# EAGLE schematic GainAmp (EAGLE 9.6.2)
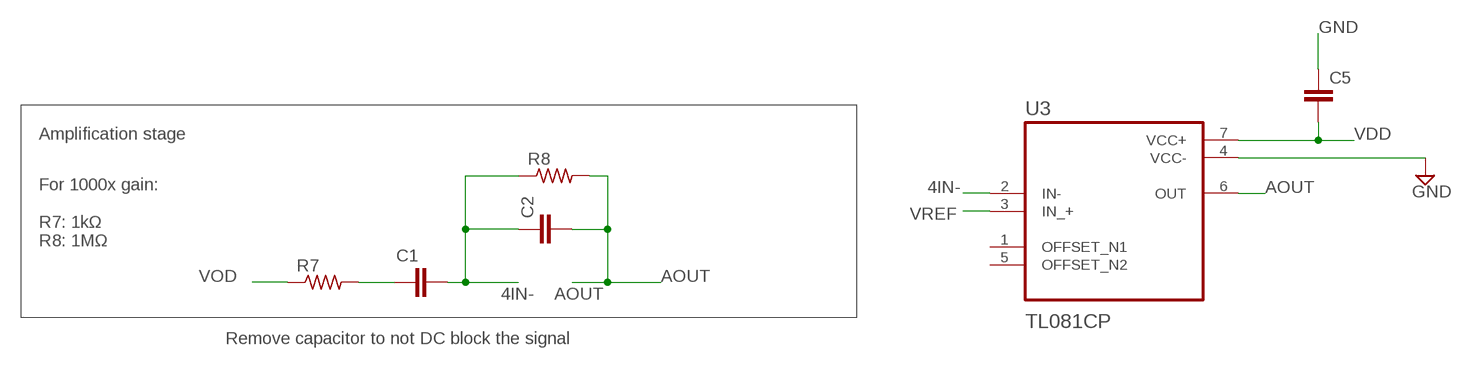
[diagram p0: schematic, sheet 1]

## Parts
C1  C2.5/2  [C2.5-2]
C2  C2.5/2  [C2.5-2]
C5  C2.5/2  [C2.5-2]
R7  R-US_0204/5  [0204/5]
R8  R-US_0204/5  [0204/5]
U3  TL081CP  [DIP794W45P254L959H508Q8]

## Nets
4IN-: C1.2 C2.1 R8.1 U3.2(IN-)
AOUT: C2.2 R8.2 U3.6(OUT)
GND: C5.1
N$7: U3.4(VCC-)
N$8: U3.7(VCC+)
N$9: C1.1 R7.2
VDD: C5.2
VOD: R7.1
VREF: U3.3(IN_+)
Unconnected: U3.1(OFFSET_N1) U3.5(OFFSET_N2)

## Notes on the sheet
- Amplification stage
- For 1000x gain:
  
  R7: 1kΩ
  R8: 1MΩ
- Remove capacitor to not DC block the signal

## Library data of the parts
C1 C2 C5 = capacitor-wima:C: CAPACITOR naming: grid - package width
R7 R8 = rcl:R-US_: RESISTOR, American symbol; SPICEPREFIX: R
U3 = TL081CP:TL081CP: Check availability <https://pricing.snapeda.com/parts/TL081CP/Texas%20Instruments/view-part?ref=eda>; AVAILABILITY: In Stock; CHECK_PRICES: https://www.snapeda.com/parts/TL081CP/Texas+Instruments/view-part/?ref=eda; DESCRIPTION: Single, 30-V, 3-MHz, 13-V/µs slew rate, In to V+, JFET-input op amp; MF: Texas Instruments; MP: TL081CP; PACKAGE: PDIP-8 Texas; PRICE: None; PURCHASE-URL: https://www.snapeda.com/api/url_track_click_mouser/?unipart_id=51607&manufacturer=Texas Instruments&part_name=TL081CP&search_term=tl081; SNAPEDA_LINK: https://www.snapeda.com/parts/TL081CP/Texas+Instruments/view-part/?ref=snap